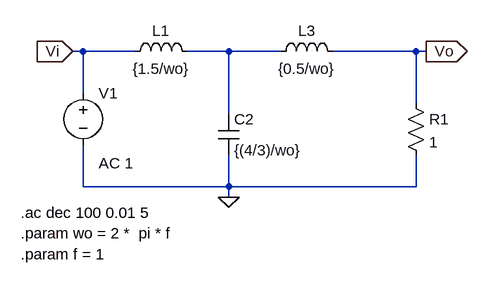
[diagram p0: schematic Draft1.asc]
Draft1.asc, the LTspice schematic file:
Version 4
SHEET 1 880 680
WIRE 16 160 0 160
WIRE 96 160 16 160
WIRE 240 160 176 160
WIRE 320 160 240 160
WIRE 528 160 400 160
WIRE 544 160 528 160
WIRE 16 224 16 160
WIRE 528 240 528 160
WIRE 240 256 240 160
WIRE 16 368 16 304
WIRE 240 368 240 320
WIRE 240 368 16 368
WIRE 528 368 528 320
WIRE 528 368 240 368
WIRE 240 384 240 368
FLAG 0 160 Vi
IOPIN 0 160 In
FLAG 544 160 Vo
IOPIN 544 160 Out
FLAG 240 384 0
SYMBOL ind 80 176 R270
WINDOW 0 32 56 VTop 2
WINDOW 3 5 56 VBottom 2
SYMATTR InstName L1
SYMATTR Value {1.5/wo}
SYMBOL ind 304 176 R270
WINDOW 0 32 56 VTop 2
WINDOW 3 5 56 VBottom 2
SYMATTR InstName L3
SYMATTR Value {0.5/wo}
SYMBOL cap 224 256 R0
SYMATTR InstName C2
SYMATTR Value {(4/3)/wo}
SYMBOL res 512 224 R0
SYMATTR InstName R1
SYMATTR Value 1
SYMBOL voltage 16 208 R0
WINDOW 123 24 124 Left 2
WINDOW 39 0 0 Left 0
SYMATTR Value2 AC 1
SYMATTR InstName V1
SYMATTR Value ""
TEXT -80 408 Left 2 !.ac dec 100 0.01 5
TEXT -80 440 Left 2 !.param wo = 2 *  pi * f
TEXT -80 472 Left 2 !.param f = 1

The netlist it stands for:
* Draft1.asc
L1 Vi N001 {1.5/wo}
L3 N001 Vo {0.5/wo}
C2 N001 0 {(4/3)/wo}
R1 Vo 0 1
V1 Vi 0 AC 1
.ac dec 100 0.01 5
.param wo = 2 *  pi * f
.param f = 1
.backanno
.end

* Results of the author's LTspice run, read from the files saved beside the schematic
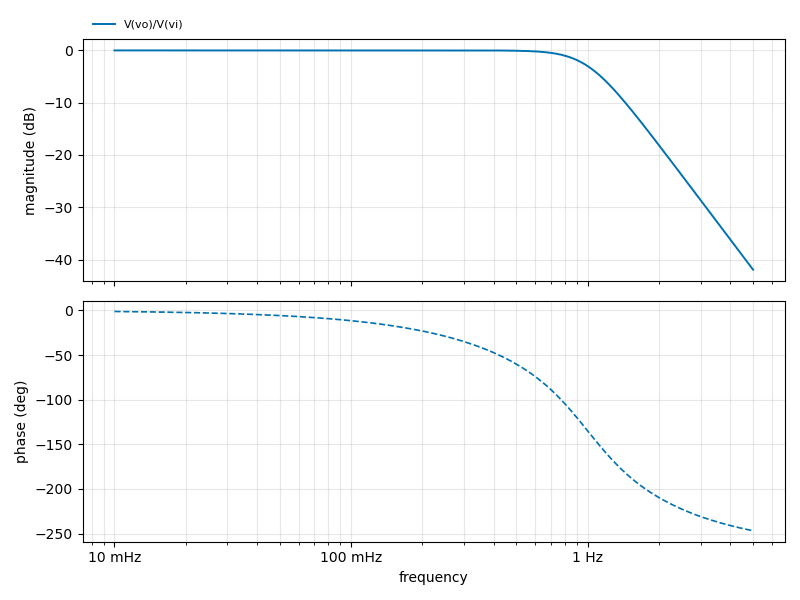
[diagram p1: AC Analysis of Draft1.asc, plotted from the saved traces]
* AC Analysis, 1 run:
*   V(vo)/V(vi): -0.02 dB at 10 mHz, -41.94 dB at 5 Hz, peak -0.02 dB at 223.9 mHz, 3 dB below the peak at 1.001 Hz